# EAGLE design MP2565_dev_v1-eagle_7.6 (EAGLE 7.7.0)
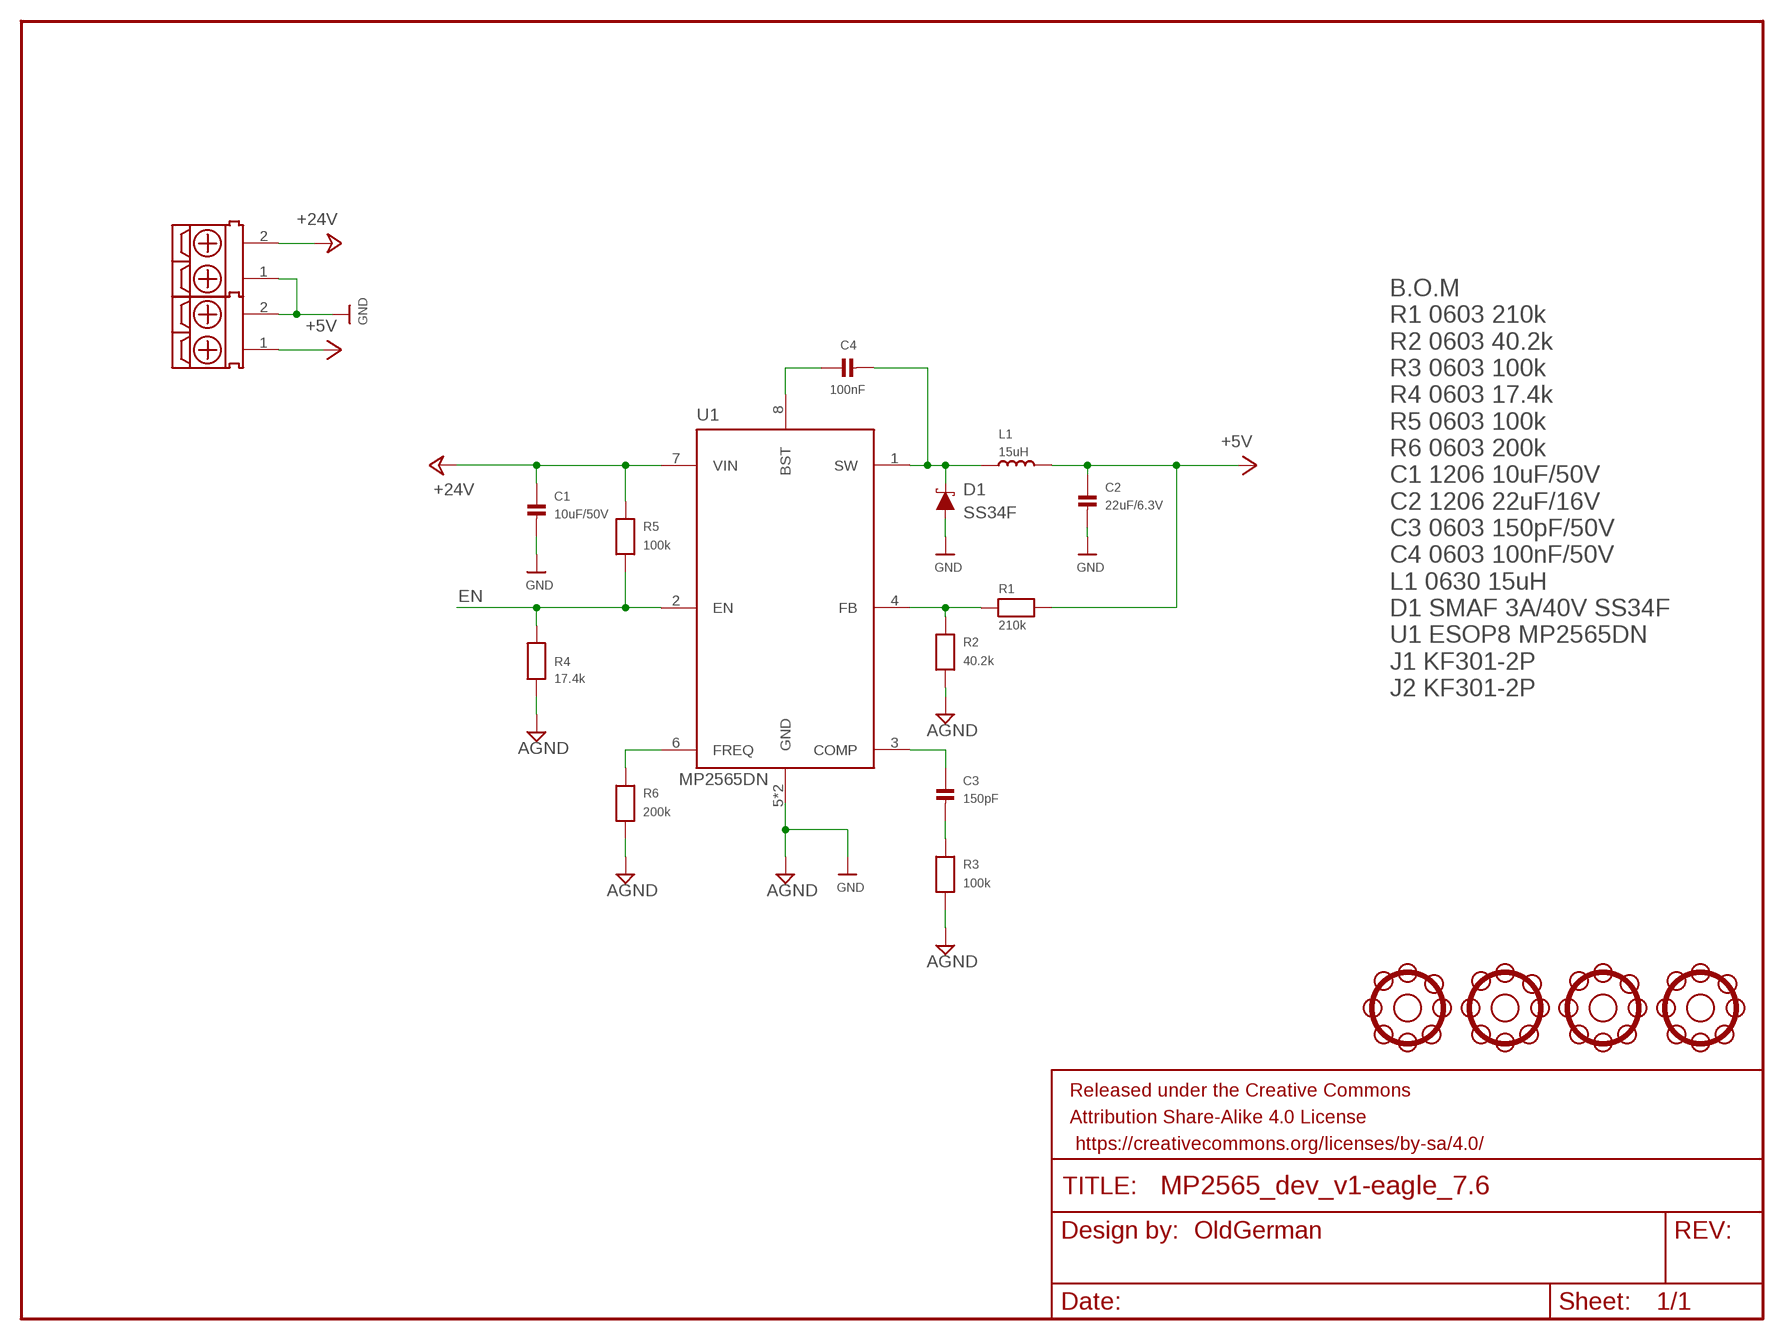
[diagram p0: schematic, sheet 1]

## Parts
C1  10uF/50V  CAP_CERAMIC1206  [1206]
C2  22uF/6.3V  CAP_CERAMIC1206  [1206]
C3  150pF  CAP_CERAMIC0603  [0603]
C4  100nF  CAP_CERAMIC0603  [0603]
D1  SS34F  [SMAF]
FRAME1  FRAME-LETTER  [CREATIVE_COMMONS]
J1  KF301_2P-5.0MM  [KF301__2P-5.0MM]
J2  KF301_2P-5.0MM  [KF301__2P-5.0MM]
L1  15uH  INDUCTOR'0630'  [L0630]
R1  210k  RESISTOR0603  [0603]
R2  40.2k  RESISTOR0603  [0603]
R3  100k  RESISTOR0603  [0603]
R4  17.4k  RESISTOR0603  [0603]
R5  100k  RESISTOR0603  [0603]
R6  200k  RESISTOR0603  [0603]
U1  MP2565DN  [ESOP8L-1.27-5X3.9MM]
U$13  SUN_HOLE_M3  [SUN_HOLE_M3]
U$14  SUN_HOLE_M3  [SUN_HOLE_M3]
U$15  SUN_HOLE_M3  [SUN_HOLE_M3]
U$16  SUN_HOLE_M3  [SUN_HOLE_M3]

## Nets
+5V: C2.1 J2.1 L1.2 R1.2
+24V: C1.1 J1.2 R5.2 U1.7(VIN)
EN: R4.1 R5.1 U1.2(EN)
GND: C1.2 C2.2 D1.A J1.1 J2.2 R2.1 R3.1 R4.2 R6.1 U1.5(GND) U1.PAD(GND) ; supply symbol labelled AGND
N$1: C4.2 D1.C L1.1 U1.1(SW)
N$2: C4.1 U1.8(BST)
N$3: R1.1 R2.2 U1.4(FB)
N$4: C3.2 R3.2
N$6: R6.2 U1.6(FREQ)
N$8: C3.1 U1.3(COMP)

## Notes on the sheet
- B.O.M
  R1 0603 210k
  R2 0603 40.2k
  R3 0603 100k
  R4 0603 17.4k
  R5 0603 100k
  R6 0603 200k
  C1 1206 10uF/50V
  C2 1206 22uF/16V
  C3 0603 150pF/50V
  C4 0603 100nF/50V
  L1 0630 15uH
  D1 SMAF 3A/40V SS34F
  U1 ESOP8 MP2565DN
  J1 KF301-2P
  J2 KF301-2P
- OldGerman

## Library data of the parts
C1-C4 = microbuilder:CAP_CERAMIC: Ceramic Capacitors 0402 - 0402 Surface Mount Capacitors 16pF 50V 5% [Digikey: 445-4899-2-ND] 18pF 50V 5% [Digikey: 490-1281-2-ND] 22pF 50V 5% [Digikey: 490-1283-2-ND] 68pF 50V 5% [Digikey: 490-1289-2-ND] 0.1uF 10V 10% [Digikey: 490-1318-2-ND] 1.0uF 6.3V 10% [Digikey: 490-1320-2-ND] 0603 - 0603 Surface Mount Capacitors 16 pF 50V 5% [Digikey: 445-5051-2-ND] 22 pF 50V [Digikey: PCC220ACVTR-ND] 33 pF 50V 5% [Digikey: 490-1415-1-ND] 56pF 50V 5% [Digikey: 490-1421-1-ND] 220pF 50V 5% [Digikey: 445-1285-1-ND] 680 pF 50V 2200 pF 50V 5% C0G [Digikey: 445-1297-1-ND] 5600 pF 100V 5% X7R [Digikey: 478-3711-1-ND] 0.1 µF 25V 10% [Digikey: PCC2277TR-ND] 0.22 µF 16V 10% X7R [Digikey: 445-1318-1-ND] 1.0 µF 25V 10% [Digikey: 445-5146-2-ND] 0603 - RF Specific 3pF 250V +/-0.1pF RF [Digikey: 712-1347-1-ND] 18 pF 250V 5% [Digikey: 478-3505-1-ND or 712-1322-1-ND] 56 pF 250V 5% C0G RF [Digikey: 490-4867-1-ND] 68 pF 250V RF [Digikey: 490-4868-1-ND] 0805 - 0805 Surface Mount Capacitors 220 pF 250V 2% RF Ceramic Capacitor [Digikey: 712-1398-1-ND] 1000 pF 50V 2% NP0 Ceramic Capacitor [Digikey: 478-3760-1-ND] 0.1 µF 25V 10% Ceramic Capacitor [Digikey: PCC1828TR-ND] 1.0 µF 16V 10% Ceramic Capacitor[Digikey: 490-1691-2-ND] 10.0 µF 10V 10% Ceramic Capacitor[Digikey: 709-1228-1-ND] 10.0 uF 16V 10% Ceramic Capacitor [Digikey: 478-5165-2-ND] 47 uF 6.3V 20% Ceramic Capacitor [Digikey: 587-1779-1-ND or 399-5506-1-ND] 1206 - 1206 Surface Mount Capacitors 47uF 10V 20% Ceramic Capacitor [Digikey: 490-5528-1-ND or 399-5508-1-ND or 445-6010-1-ND] 100uF 6.3V -20%, +80% Y5V Ceramic Capacitor (Digikey: 490-4512-1-ND, Mouser: 81-GRM31CF50J107ZE1L)
D1 = DIP:SS34F
FRAME1 = SparkFun-Aesthetics:FRAME-LETTER: Schematic Frame - Letter Standard 8.5x11 US Letter frame
J1 J2 = DIP:KF301_2P-5.0MM
L1 = DIP:INDUCTOR
R1-R6 = microbuilder:RESISTOR: Resistors 0402 - 0402 Surface Mount Package 22 Ohm 1% 1/16W [Digikey: 311-22.0LRTR-ND] 33 Ohm 5% 1/16W 1.0K 5% 1/16W 1.5K 5% 1/16W 2.0K 1% 1/16W 10.0K 1% 1/16W [Digikey: 311-10.0KLRTR-ND] 10.0K 5% 1/16W [Digikey: RMCF0402JT10K0TR-ND] 12.1K 1% 1/16W [Digikey: 311-22.0LRTR-ND] 100.0K 5% 1/16W 0603 - 0603 Surface Mount Package 0 Ohm 1/10 Watt 1% Resistor 15 Ohm 1/10 Watt 1% Resistor 33 Ohm 1/10 Watt 1% Resistor 49.9 Ohm 1/10 Watt 1% Resistor 100 Ohm 1/10 Watt 1% Resistor 150 Ohm 1/10 Watt 1% Resistor 240 Ohm 1/10 Watt 1% Resistor 390 Ohm 1/10 Watt 1% Resistor 560 Ohm 1/10 Watt 1% Resistor 680 Ohm 1/10 Watt 1% Resistor 750 Ohm 1/10 Watt 1% Resistor 1.0K Ohm 1/10 Watt 1% Resistor 1.5K Ohm 1/10 Watt 1% Resistor 2.0K Ohm 1/10 Watt 1% Resistor 2.2K Ohm 1/10 Watt 1% Resistor 3.3K Ohm 1/10 Watt 1% Resistor 4.7K Ohm 1/10 Watt 1% Resistor 10.0K Ohm 1/10 Watt 1% Resistor 12.0K Ohm 1/10 Watt 1% Resistor 12.1K Ohm 1/10 Watt 1% Resistor 20.0K Ohm 1/10 Watt 1% Resistor 33.0K Ohm 1/10 Watt 1% Resistor 100.0K Ohm 1/10 Watt 1% Resistor 0805 - 0805 Surface Mount Package 0 Ohm 1/8 Watt 1% Resistor 33 Ohm 1/8 Watt 1% Resistor 100 Ohm 1/8 Watt 1% Resistor 150 Ohm 1/8 Watt 1% Resistor 200 Ohm 1/8 Watt 1% Resistor 240 Ohm 1/8 Watt 1% Resistor 330 Ohm 1/8 Watt 1% Resistor 390 Ohm 1/8 Watt 1% Resistor 470 Ohm 1/8 Watt 1% Resistor 1.0K Ohm 1/8 Watt 1% Resistor 1.5K Ohm 1/8 Watt 1% Resistor 2.0K Ohm 1/8 Watt 1% Resistor 4.7K Ohm 1/8 Watt 1% Resistor 5.1K Ohm 1/8 Watt 1% Resistor 5.6K Ohm 1/8 Watt 1% Resistor 10.0K Ohm 1/8 Watt 1% Resistor 22.0K Ohm 1/8 Watt 1% Resistor 33.0K Ohm 1/8 Watt 1% Resistor 100K Ohm 1/8 Watt 1% Resistor 1206 - 1206 Surface Mount Package 2012 - 2010 Surface Mount Package 0.11 Ohm 1/2 Watt 1% Resistor - Digikey: RHM.11UCT-ND
U1 = DIP:MP2565DN
U$13-U$16 = DIP:SUN_HOLE_M3

## Board
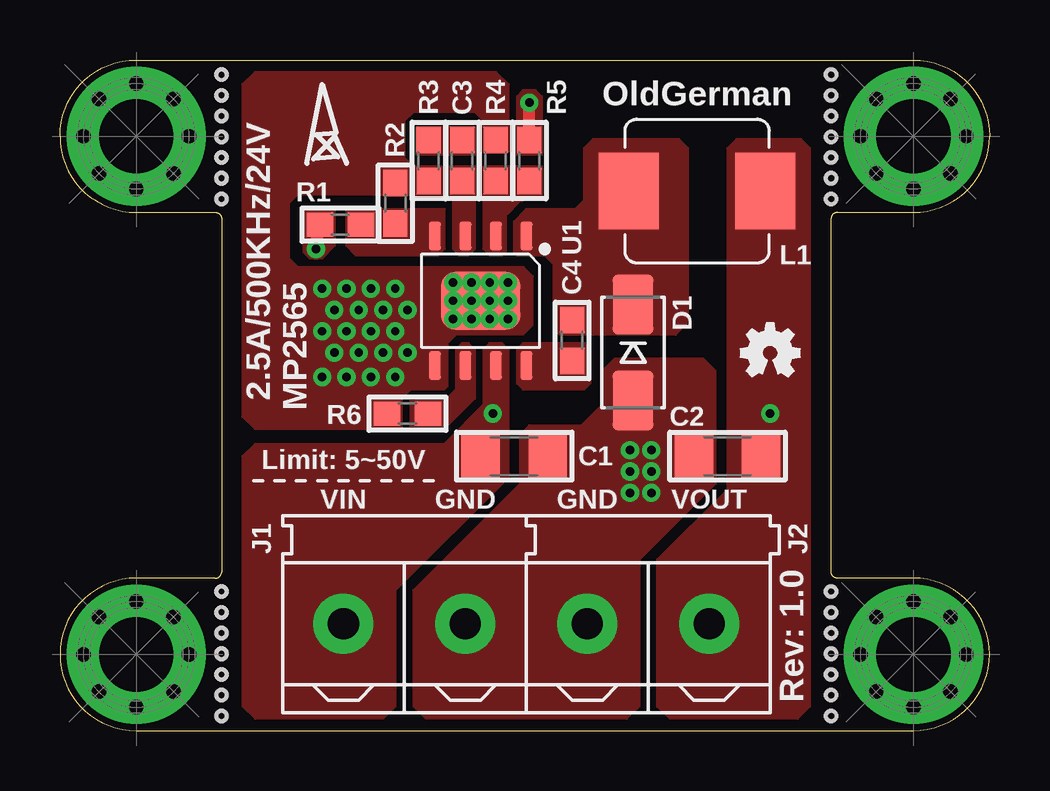
[diagram p1: board, top side]
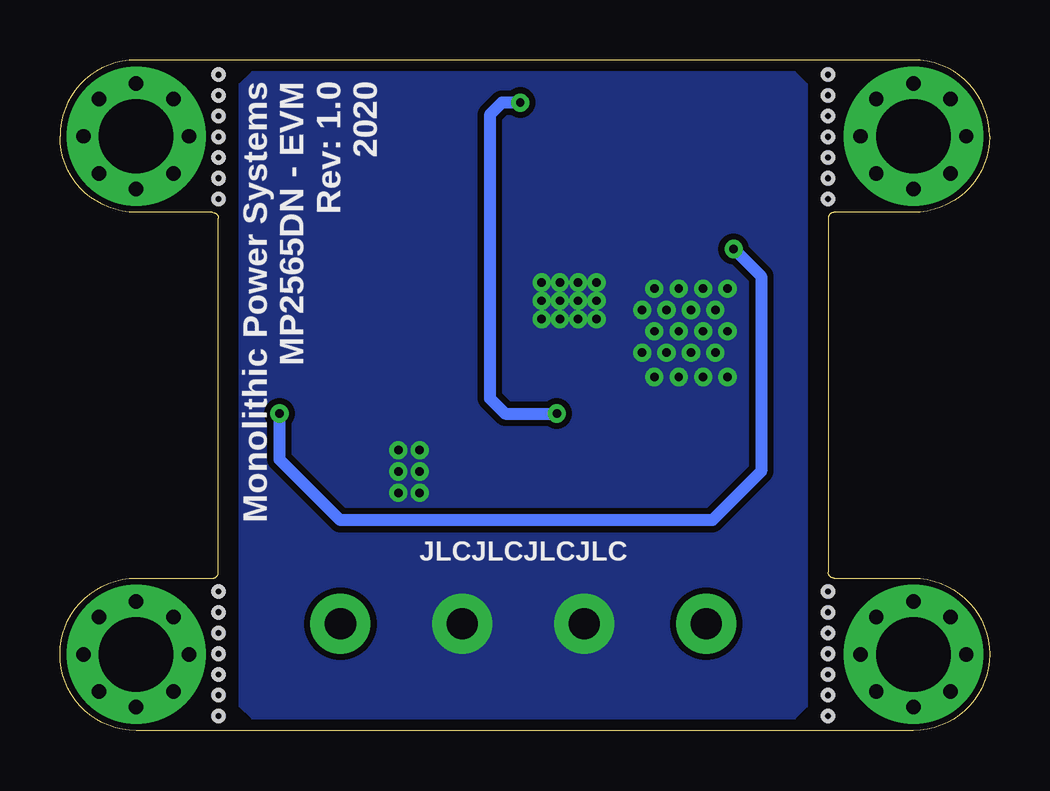
[diagram p2: board, bottom side, seen from below]

Size 38.73 x 27.94 mm. Coordinates in mm from the lower left corner, seen from the top.
Outline: 0,24.77 arc-90 3.18,27.94 35.56,27.94 arc-90 38.73,24.77 arc-90 35.56,21.59 32.39,21.59 arc90 32.13,21.34 32.13,6.6 arc90 32.39,6.35 35.56,6.35 arc-90 38.73,3.17 arc-90 35.56,0 3.18,0 arc-90 0,3.17 arc-90 3.18,6.35 6.48,6.35 arc90 6.73,6.6 6.73,21.34 arc90 6.48,21.59 3.18,21.59 arc-90 0,24.77
Copper layers (1*16): Top 0.035mm / dielectric 1.5mm / Bottom 0.035mm
Design rules "default *": minimum track width 6mil, minimum drill 0.35mm, track to track 10mil, track to pad 10mil, pad to pad 10mil, via to via 10mil, smd to smd 10mil, copper to edge 10mil, drill to drill 6mil, minimum pad ring 10mil, minimum via ring 8mil, stop-mask expansion 4mil, vias tented up to drill 15mil, thermal gap 10mil
Holes 0.51 mm at 6.73,22.15 6.73,23.01 6.73,23.88 6.73,24.74 6.73,25.6 6.73,26.47 6.73,27.33 32.13,22.15 32.13,23.01 32.13,23.88 32.13,24.74 32.13,25.6 32.13,26.47 32.13,27.33 32.13,0.61 32.13,1.47 32.13,2.34 32.13,3.2 32.13,4.06 32.13,4.93 32.13,5.79 6.73,0.61 6.73,1.47 6.73,2.34 6.73,3.2 6.73,4.06 6.73,4.93 6.73,5.79
Holes 0.35 mm at 6.73,22.15 6.73,23.01 6.73,23.88 6.73,24.74 6.73,25.6 6.73,26.47 6.73,27.33 32.13,22.15 32.13,23.01 32.13,23.88 32.13,24.74 32.13,25.6 32.13,26.47 32.13,27.33 32.13,0.61 32.13,1.47 32.13,2.34 32.13,3.2 32.13,4.06 32.13,4.93 32.13,5.79 6.73,0.61 6.73,1.47 6.73,2.34 6.73,3.2 6.73,4.06 6.73,4.93 6.73,5.79

### Footprints (pad centres in the part's own frame; a part is rotated, then mirrored left to right if it is on the bottom)
1206 = smd 1.6 x 1.8: 1 -1.4,0; 2 1.4,0
0603 = smd 1.1 x 1: 1 -0.85,0; 2 0.85,0
SMAF = smd 2.5 x 1.7: A 2,0; C -2,0
KF301__2P-5.0MM = drill 1.3 pad 2.5: 1 0,-2.54; 2 0,2.54
L0630 = smd 2.5 x 3.2: 1 -2.85,0; 2 2.85,0
ESOP8L-1.27-5X3.9MM = smd 0.5 x 1.2: 1 -1.905,-2.7; 2 -0.635,-2.7; 3 0.635,-2.7; 4 1.905,-2.7; 5 1.905,2.7; 6 0.635,2.7; 7 -0.635,2.7; 8 -1.905,2.7 | smd 3.3 x 2.4: PAD 0,0
SUN_HOLE_M3 = drill 3.1 pad 5.8: P$1 0,0 | drill 0.6 pad 1: P$2 0,2.2; P$3 0,-2.2; P$4 -2.2,0; P$5 2.2,0; P$6 1.55,1.55; P$7 1.55,-1.55; P$8 -1.55,1.55; P$9 -1.55,-1.55

### Placement (x,y rotation side)
C1  18.92,11.43 0 top
C2  27.81,11.43 180 top
C3  16.76,23.75 90 top
C4  21.34,16.26 90 top
D1  23.88,15.75 270 top
FRAME1  17.14,-10.41 0 top  (outside the outline)
J1  14.35,4.45 90 top
J2  24.51,4.45 90 top
L1  26.54,22.48 0 top
R1  11.68,21.08 180 top
R2  13.97,21.97 270 top
R3  15.37,23.75 90 top
R4  18.16,23.75 90 top
R5  19.56,23.75 90 top
R6  14.48,13.21 0 top
U1  17.53,17.91 180 top
U$1  [OSHW-LOGO-MINI]  29.59,15.75 0 top
U$13  3.18,3.17 0 top
U$14  3.18,24.77 0 top
U$15  35.56,3.17 0 top
U$16  35.56,24.77 0 top

### Tracks (layer width: path | path; a pad name or v marks a point on that pad's centre or on a via)
+5V  (via drill 0.35)
  Top 0.508: R1.2 10.71,20.95 10.71,20.11 v10.67,20.07
  Bottom 0.508: v10.67,20.07 9.53,18.92 9.53,10.79 11.56,8.76 27.05,8.76 29.59,11.3 v29.59,13.21
  pour Top (no thermals): 27.81,24.26 27.81,10.03 24.89,7.11 24.89,1.02 25.4,0.51 30.73,0.51 31.24,1.02 31.24,24.26 30.86,24.64 28.19,24.64
  pour Top (no thermals): 10.41,19.68 10.16,19.94 10.16,21.72 11.43,21.72 11.43,20.19 10.92,19.68
+24V  (via drill 0.35)
  Top 0.508: R5.2 v19.56,26.16
  Bottom 0.508: v19.56,26.16 20.32,26.16 20.83,25.65 20.83,13.84 20.19,13.21 v18.03,13.21
  pour Top (no thermals): 17.91,16.13 18.41,16.13 18.67,15.88 18.67,10.54 13.97,5.84 13.97,1.02 13.46,0.51 8.13,0.51 7.62,1.02 7.62,11.43 8.13,11.94 16,11.94 17.65,13.59 17.65,15.88
  pour Top (no thermals): 19.05,24 19.05,26.42 19.3,26.67 19.81,26.67 20.07,26.42 20.07,24
EN
  pour Top (rank 2, no thermals): 17.65,20.07 17.65,23.5 20.07,23.5 20.07,22.23 19.43,22.23 18.67,21.46 18.67,20.07 18.41,19.81 17.91,19.81
GND  (via drill 0.35)
  other vias: 16.38,18.67 16.38,17.91 16.38,17.14 17.14,18.67 17.14,17.91 17.14,17.14 17.91,18.67 17.91,17.91 17.91,17.14 18.67,18.67 18.67,17.91 18.67,17.14 10.92,18.41 11.94,18.41 12.95,18.41 13.97,18.41 11.43,17.53 12.45,17.53 13.46,17.53 14.48,17.53 14.48,15.75 10.92,16.64 11.94,16.64 12.95,16.64 13.97,16.64 11.43,15.75 12.45,15.75 13.46,15.75 10.92,14.73 11.94,14.73 12.95,14.73 13.97,14.73 24.64,11.68 24.64,10.79 24.64,9.91 23.75,11.68 23.75,10.79 23.75,9.91
  pour Top (no thermals): 19.18,10.29 19.18,12.32 19.56,12.7 21.72,12.7 22.61,13.59 22.61,14.99 23.11,15.49 26.8,15.49 27.3,14.99 27.3,10.29 24.13,7.11 24.13,1.02 23.62,0.51 15.24,0.51 14.73,1.02 14.73,5.84
  pour Top (no thermals): 14.22,13.84 14.22,12.57 8.13,12.57 7.62,13.08 7.62,26.92 8.13,27.43 18.16,27.43 18.67,26.92 18.67,24.13 17.65,24.13 17.65,25.4 17.27,25.78 14.73,25.78 14.35,25.4 14.35,23.88 14.73,23.5 15.88,23.5 15.88,22.35 9.91,22.35 9.53,21.97 9.53,19.68 9.91,19.3 19.3,19.3 19.69,18.92 19.69,16.89 19.3,16.51 16.51,16.51 16.13,16.13 16.13,14.35 16,14.22 14.61,14.22
  pour Bottom (no thermals): 7.62,26.92 8.13,27.43 30.73,27.43 31.24,26.92 31.24,1.02 30.73,0.51 8.13,0.51 7.62,1.02
N$1
  pour Top (no thermals): 18.92,19.94 18.92,21.21 19.43,21.72 21.46,21.72 21.84,22.1 21.84,24.26 22.23,24.64 25.78,24.64 26.16,24.26 26.16,17.02 25.65,16.51 20.83,16.51 20.57,16.76 20.57,19.43 20.19,19.81 19.05,19.81
N$2
  pour Top (no thermals): 19.05,15.88 19.3,16.13 21.84,16.13 22.1,15.88 22.1,14.48 21.84,14.22 19.3,14.22 19.05,14.48
N$3
  pour Top (no thermals): 11.94,21.72 11.94,20.19 12.32,19.81 15.75,19.81 16,20.07 16,21.72
N$4
  pour Top (no thermals): 14.86,25.15 14.86,24 17.27,24 17.27,25.15
N$6
  pour Top (no thermals): 14.61,13.72 14.61,12.7 16.13,12.7 17.27,13.84 17.27,15.88 17.02,16.13 16.76,16.13 16.51,15.88 16.51,14.22 16,13.72
N$8
  pour Top (no thermals): 16.26,23.5 16.26,22.35 16.38,22.23 16.38,20.07 16.64,19.81 17.02,19.81 17.27,20.07 17.27,23.5

### Text on the board
tPlace: OldGerman | 2.5A/500KHz/24V | D1 | MP2565 | Limit: 5~50V | VIN | GND | GND | VOUT | J1 | J2 | Rev: 1.0
bPlace: Monolithic Power Systems / MP2565DN - EVM / Rev: 1.0 / 2020 | JLCJLCJLCJLC